# Altium schematic sheet U2S_HVPP.SchDoc
size 127 x 101 mm
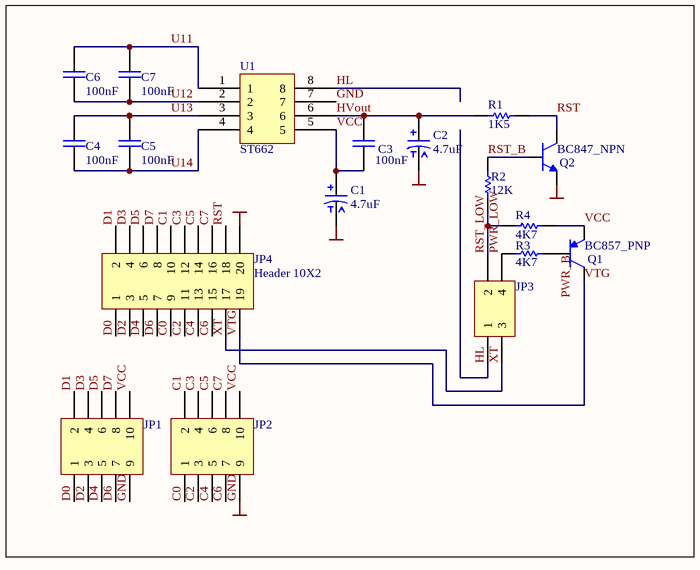
[diagram p0: U2S_HVPP.SchDoc]

## Parts
C1  value 4.7uF  [TR3A]  (hidden comment: Capacitor Ta)
C2  value 4.7uF  [TR3A]  (hidden comment: Capacitor Ta)
C3  value 100nF  [SMD0603]  (hidden comment: Capacitor)
C4  value 100nF  [SMD0603]  (hidden comment: Capacitor)
C5  value 100nF  [SMD0603]  (hidden comment: Capacitor)
C6  value 100nF  [SMD0603]  (hidden comment: Capacitor)
C7  value 100nF  [SMD0603]  (hidden comment: Capacitor)
JP1  Header 5X2  [HDR2X5]  (value not drawn)
JP2  Header 5X2  [HDR2X5]  (value not drawn)
JP3  Header 2X2  [HDR2X2]  (value not drawn)
JP4  Header 10X2  [HDR2X10]
Q1  BC857_PNP  [SOT23]
Q2  BC847_NPN  [SOT23]
R1  value 1K5  [SMD0805]  (hidden comment: Resistor)
R2  value 12K  [SMD0603]  (hidden comment: Resistor)
R3  value 4K7  [SMD0603]  (hidden comment: Resistor)
R4  value 4K7  [SMD0603]  (hidden comment: Resistor)
U1  ST662  [SO8]

## Nets
GND: C1.2 C2.2 JP1.9 JP2.9 JP4.20 Q2.E U1.7
C0: JP2.1 JP4.9
C1: JP2.2 JP4.10
C2: JP2.3 JP4.11
C3: JP2.4 JP4.12
C4: JP2.5 JP4.13
C5: JP2.6 JP4.14
C6: JP2.7 JP4.15
C7: JP2.8 JP4.16
D0: JP1.1 JP4.1
D1: JP1.2 JP4.2
D2: JP1.3 JP4.3
D3: JP1.4 JP4.4
D4: JP1.5 JP4.5
D5: JP1.6 JP4.6
D6: JP1.7 JP4.7
D7: JP1.8 JP4.8
HL: JP3.1 U1.8
HVout: C2.1 C3.2 R1.1 U1.6
PWR_B: Q1.B R3.2
PWR_LOW: JP3.4 R3.1
RST: JP4.18 Q2.C R1.2
RST_B: Q2.B R2.2
RST_LOW: JP3.2 R2.1 R4.2
U11: C6.1 C7.2 U1.1
U12: C6.2 C7.1 U1.2
U13: C4.2 C5.2 U1.3
U14: C4.1 C5.1 U1.4
VCC: C1.1 C3.1 JP1.10 JP2.10 Q1.E R4.1 U1.5
VTG: JP4.19 Q1.C
XT: JP3.3 JP4.17

## Library data of the parts
JP1 JP2 = Header 5X2: Header, 5-Pin, Dual row; Revision: 17-Jul-2002: Re-released for DXP Platform.; Publisher: Altium Limited
JP3 = Header 2X2: Header, 2-Pin, Dual row; Revision: 17-Jul-2002: Re-released for DXP Platform.; Publisher: Altium Limited
JP4 = Header 10X2: Header, 10-Pin, Dual row; Revision: 17-Jul-2002: Re-released for DXP Platform.; Publisher: Altium Limited
Q1 = Transistor_PNP
Q2 = Transistor_NPN